# Altium schematic sheet MCU.SchDoc
size A3; Organization: Rotronic AG; Address1: Grindelstrasse 6; Address2: 8303 Bassersdorf; Address3: Switzerland; DocumentNumber: 2; SheetNumber: 2; SheetTotal: 10; Web_Address: www.rotronic.ch; E_Mail_Address: *@rotronic.ch; Fon: +41 (0)44 838 11 11; Fax: +41 (0)44 836 44 24
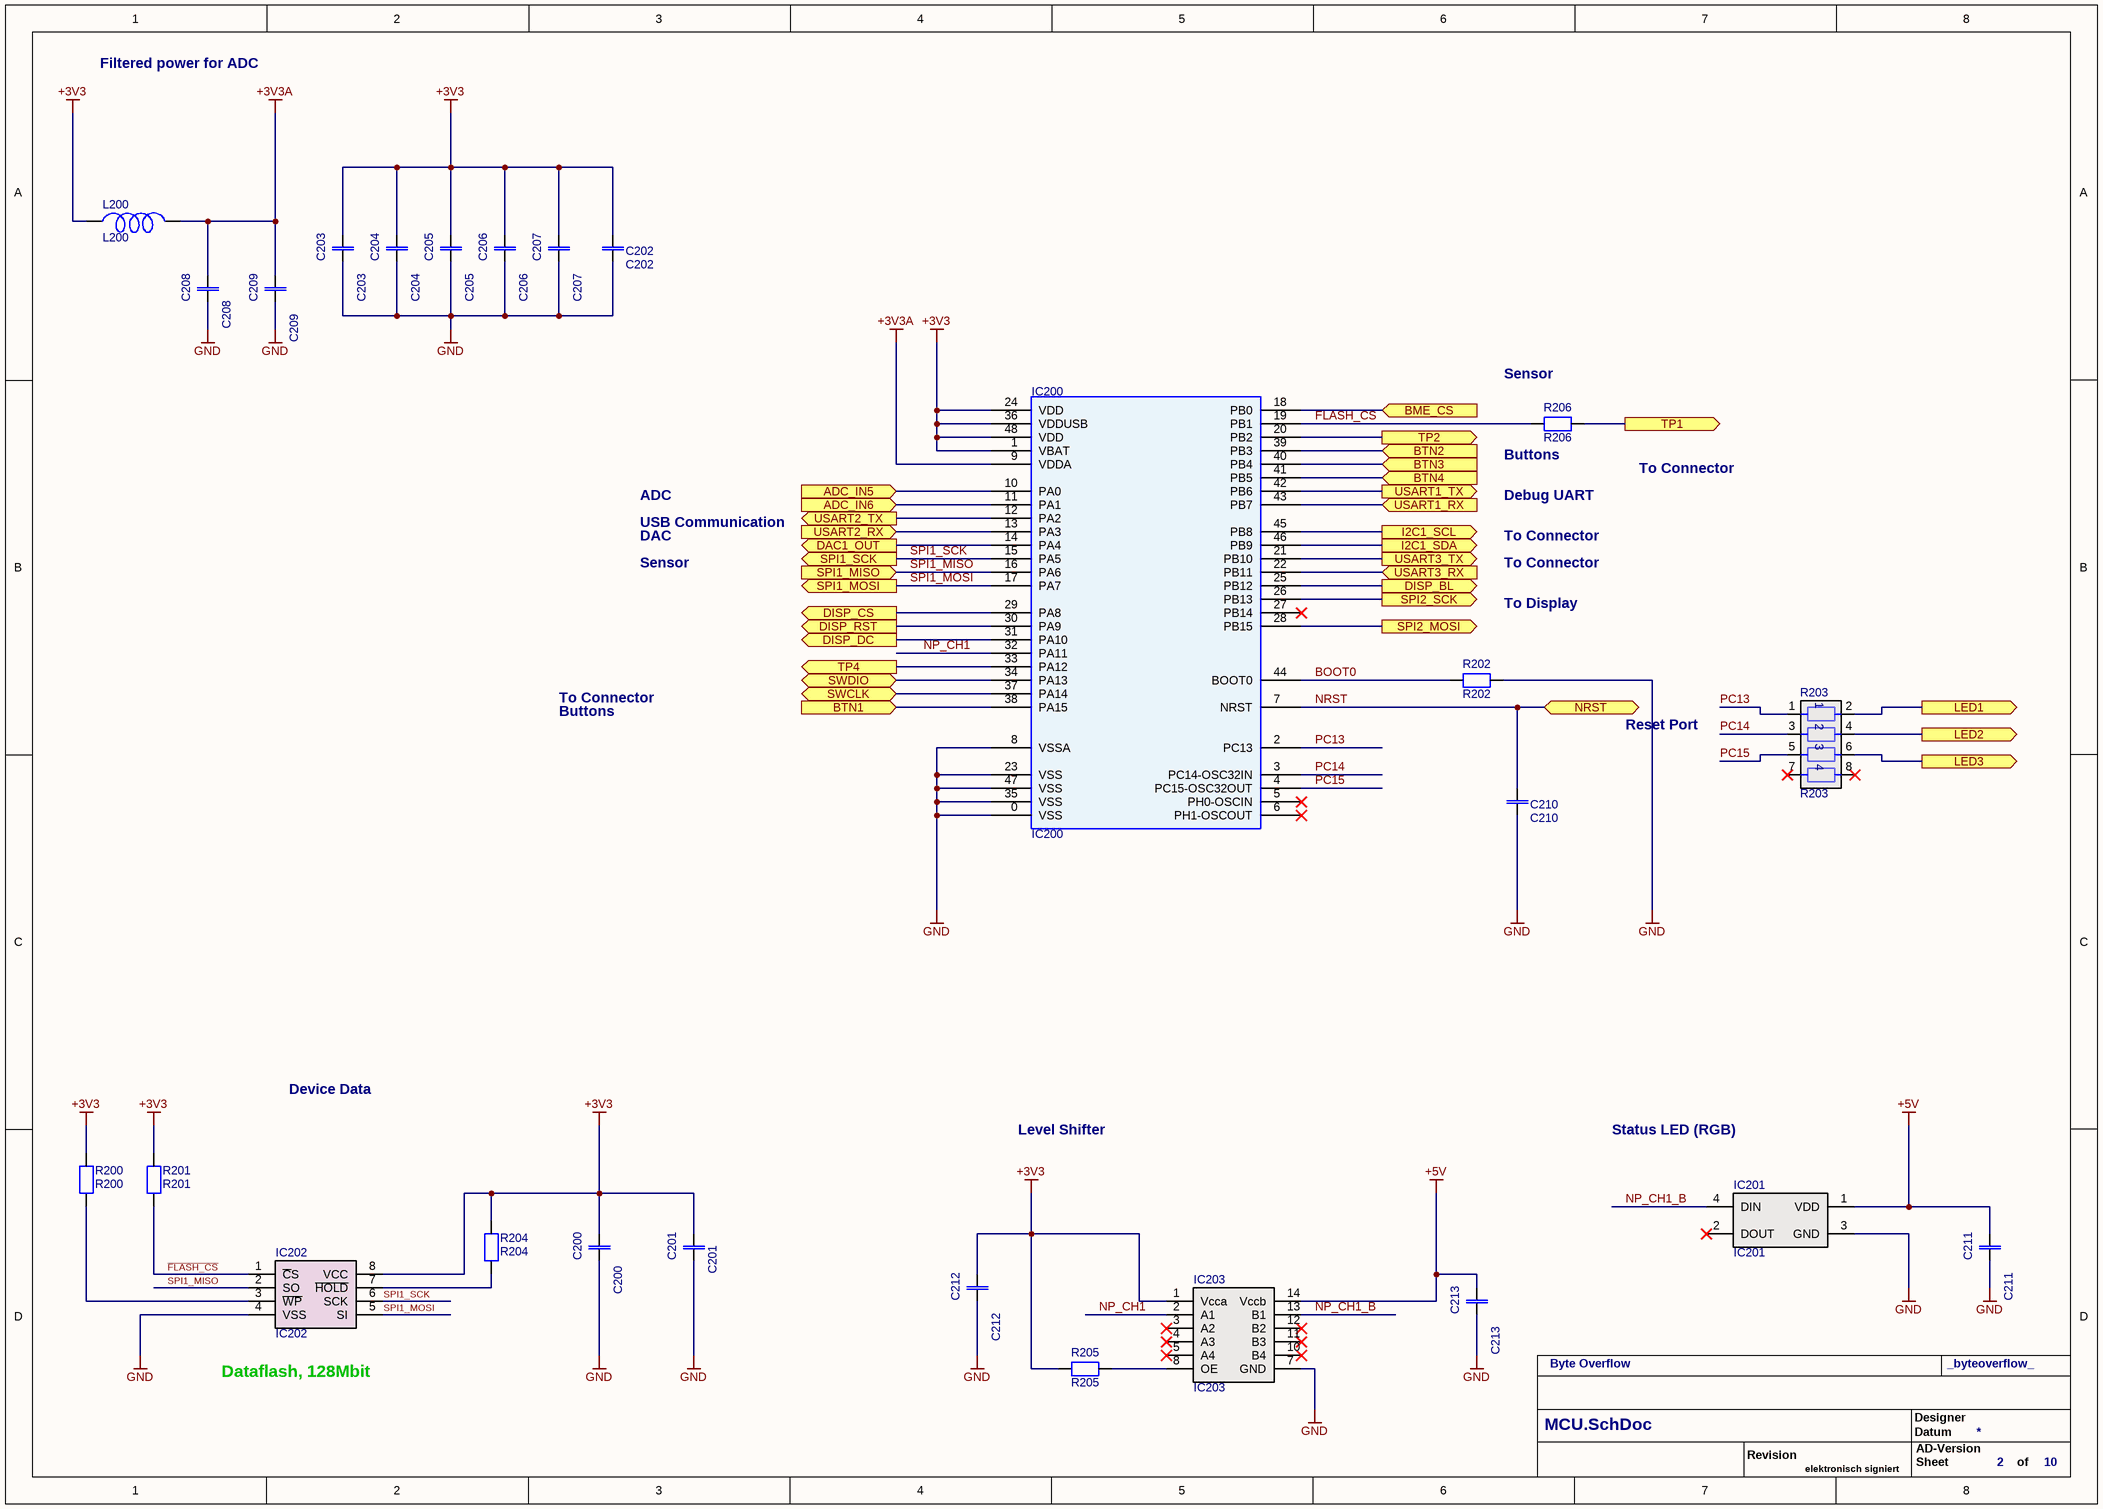
[diagram p0: MCU.SchDoc]

## Parts
C200  C200  [0603-1608]
C201  C201  [0805-2012]
C202  C202  [0603-1608]
C203  C203  [0603-1608]
C204  C204  [0603-1608]
C205  C205  [0603-1608]
C206  C206  [0603-1608]
C207  C207  [0603-1608]
C208  C208  [0805-2012]
C209  C209  [0603-1608]
C210  C210  [0603-1608]
C211  C211  [0603-1608]
C212  C212  [0603-1608]
C213  C213  [0603-1608]
IC200  IC200  [QFN48 7x7x0.9 WIZnet]
IC201  IC201  [LED_2812]
IC202  IC202  [SOIC-8]
IC203  IC203  [TSSOP14]
L200  L200  [0603-1608]
R200  R200  [0603-1608]
R201  R201  [0603-1608]
R202  R202  [0603-1608]
R203  R203  [Array-2010-4Way]
R204  R204  [0603-1608]
R205  R205  [0805-2012]
R206  R206  [0603-1608]

## Ports
ADC_IN5 (in), ADC_IN6 (in), BME_CS (in), BTN1 (in), BTN2 (in), BTN3 (in), BTN4 (in), DAC1_OUT (out), DISP_BL (out), DISP_CS (out), DISP_DC (out), DISP_RST (out), I2C1_SCL (out), I2C1_SDA (out), LED1 (out), LED2 (out), LED3 (out), NRST (bidir), SPI1_MISO (in), SPI1_MOSI (out), SPI1_SCK (out), SPI2_MOSI (out), SPI2_SCK (out), SWCLK (bidir), SWDIO (bidir), TP1 (out), TP2 (out), TP4 (out), USART1_RX (in), USART1_TX (out), USART2_RX (in), USART2_TX (out), USART3_RX (in), USART3_TX (out)

## Nets
+3V3: C200.1 C201.1 C202.1 C203.1 C204.1 C205.1 C206.1 C207.1 C212.1 IC200.1(VBAT) IC200.24(VDD) IC200.36(VDDUSB) IC200.48(VDD) IC202.8(VCC) IC203.1(Vcca) L200.1 R200.2 R201.2 R204.2 R205.1
+3V3A: C208.1 C209.1 IC200.9(VDDA) L200.2
+5V: C211.1 C213.1 IC201.1(VDD) IC203.14(Vccb)
GND: C200.2 C201.2 C202.2 C203.2 C204.2 C205.2 C206.2 C207.2 C208.2 C209.2 C210.2 C211.2 C212.2 C213.2 IC200.0(VSS) IC200.8(VSSA) IC200.23(VSS) IC200.35(VSS) IC200.47(VSS) IC201.3(GND) IC202.4(VSS) IC203.7(GND) R202.2
~{FLASH_CS}: IC200.19(PB1) IC202.1(~{C}S) R201.1 R206.1
ADC_IN5: IC200.10(PA0) ; port ADC_IN5
ADC_IN6: IC200.11(PA1) ; port ADC_IN6
BME_CS: IC200.18(PB0) ; port BME_CS
BOOT0: IC200.44(BOOT0) R202.1
BTN1: IC200.38(PA15) ; port BTN1
BTN2: IC200.39(PB3) ; port BTN2
BTN3: IC200.40(PB4) ; port BTN3
BTN4: IC200.41(PB5) ; port BTN4
DAC1_OUT: IC200.14(PA4) ; port DAC1_OUT
DISP_BL: IC200.25(PB12) ; port DISP_BL
DISP_CS: IC200.29(PA8) ; port DISP_CS
DISP_DC: IC200.31(PA10) ; port DISP_DC
DISP_RST: IC200.30(PA9) ; port DISP_RST
I2C1_SCL: IC200.45(PB8) ; port I2C1_SCL
I2C1_SDA: IC200.46(PB9) ; port I2C1_SDA
LED1: R203.2 ; port LED1
LED2: R203.4 ; port LED2
LED3: R203.6 ; port LED3
NP_CH1: IC200.32(PA11) IC203.2(A1)
NP_CH1_B: IC201.4(DIN) IC203.13(B1)
NRST: C210.1 IC200.7(NRST) ; port NRST
PC13: IC200.2(PC13) R203.1
PC14: IC200.3(PC14-OSC32IN) R203.3
PC15: IC200.4(PC15-OSC32OUT) R203.5
SPI1_MISO: IC200.16(PA6) IC202.2(SO) ; port SPI1_MISO
SPI1_MOSI: IC200.17(PA7) IC202.5(SI) ; port SPI1_MOSI
SPI1_SCK: IC200.15(PA5) IC202.6(SCK) ; port SPI1_SCK
SPI2_MOSI: IC200.28(PB15) ; port SPI2_MOSI
SPI2_SCK: IC200.26(PB13) ; port SPI2_SCK
SWCLK: IC200.37(PA14) ; port SWCLK
SWDIO: IC200.34(PA13) ; port SWDIO
TP1: R206.2 ; port TP1
TP2: IC200.20(PB2) ; port TP2
TP4: IC200.33(PA12) ; port TP4
USART1_RX: IC200.43(PB7) ; port USART1_RX
USART1_TX: IC200.42(PB6) ; port USART1_TX
USART2_RX: IC200.13(PA3) ; port USART2_RX
USART2_TX: IC200.12(PA2) ; port USART2_TX
USART3_RX: IC200.22(PB11) ; port USART3_RX
USART3_TX: IC200.21(PB10) ; port USART3_TX
NetIC202_3: IC202.3(~{WP}) R200.1
NetIC202_7: IC202.7(~{HOLD}) R204.1
NetIC203_8: IC203.8(OE) R205.2

Not connected (* = marked no-connect by the designer): IC200 5(PH0-OSCIN)* 6(PH1-OSCOUT)* 27(PB14)*; IC201 2(DOUT)*; IC203 3(A2)* 4(A3)* 5(A4)* 6(NC) 9(NC) 10(B4)* 11(B3)* 12(B2)*; R203 7* 8*

## Notes on the sheet
- Filtered power for ADC
- (near R206) Sensor
- ADC
- Debug UART
- (near R206) Buttons
- To Connector
- USB Communication
- Sensor
- DAC
- To Display
- Buttons
- Reset Port
- Device Data
- Level Shifter
- Status LED (RGB)
- (near IC202) Dataflash, 128Mbit
- Byte Overflow
- _byteoverflow_
- Revision
- Designer
- Datum
- AD-Version
- elektronisch signiert
- Sheet
- of

## Library data of the parts
C200 C210 = F0161: Capacitor; Part-Number: 63.0104.1450; Manufacturer: KEMET; Manufacturer Part Number: C0603C104K5RACTU; ID: F0161; Operating Range: -55°C to +125°C; Note: 100nF 50V X7R 10% Kemet C0603C104K5RACTU; Specification: 05.09.2013 OPT; Value: 100nF 50V; Designator: C 100nF 50V X7R; Component Type: Standard; ComponentLink1Description: Datasheet; ComponentLink1URL: http://www.kemet.com/kemet/web/homepage/kechome.nsf/vapubfiles/KEM_C1002_X7R_SMD.pdf/$file/KEM_C1002_X7R_SMD.pdf; Pin Count: 2; Price 100: 0.007; Price 1000: 0.007; Price Date: 02.12.2019 Pro Alpha; Changed: 05.09.2013 OPT; Price: 0.01; Availability Date: 15.11.2016 OPT; Flammability: n.a.; RoHS compliant: Yes; Status: Active; Part Status: Active; RoHS: RoHS Compliant; Supplier Part Number 1: 399-5089-1-ND; Supplier 1: Digi-Key
C201 C208 = F0127: Capacitor; Part-Number: 63.0105.1500; Manufacturer: Murata Electronics North America; Manufacturer Part Number: GRM21BF51H105ZA12L; ID: F0127; Operating Range: -30°C to +85°C; Note: 1uF 50V Y5V 20% Murata GRM21BF51H105ZA12L; Specification: 27.12.2012 OPT; Value: 1uF 50V; Designator: C 1uF 50V; Component Type: Standard; Pin Count: 2; Price 100: 0.067; Price 1000: 0.067; Price Date: 02.12.2019 Pro Alpha; Changed: 27.12.2012 OPT; Price: 0.118; Availability Date: 15.11.2016 OPT; Flammability: n.a.; RoHS compliant: Yes; Status: Active; ComponentLink1Description: Datasheet; ComponentLink1URL: http://www.murata.com/products/catalog/pdf/c02e.pdf; Part Status: Discontinued at Digi-Key; RoHS: RoHS Compliant; Supplier Part Number 1: 490-3903-1-ND; ComponentLink2Description: http://search.murata.co.jp/Ceramy/image/img/A01X/G101/ENG/GRM21BF51H105ZA12-01.pdf; ComponentLink2URL: http://search.murata.co.jp/Ceramy/image/img/A01X/G101/ENG/GRM21BF51H105ZA12-01.pdf; Supplier 1: Digi-Key
C202 = F0193: Capacitor; Part-Number: 63.7000.0032; Manufacturer: Murata Electronics North America; Manufacturer Part Number: GRM188R61E475ME11D; Designator: C 4.7uF 25V; ID: F0193; Operating Range: -55°C to +85°C; Note: 4.7uF 25V X5R 20% Murata Electronics GRM188R61E475ME11D; Specification: 02.09.2015 OPT; Value: 4.7uF 25V X5R; Component Type: Standard; ComponentLink1Description: Datasheet; ComponentLink1URL: http://search.murata.co.jp/Ceramy/image/img/A01X/partnumbering_e_01.pdf; Status: Active; Availability Date: 15.11.2016 OPT; RoHS compliant: Yes; Flammability: n.a.; ComponentLink2Description: http://search.murata.co.jp/Ceramy/image/img/A01X/G101/ENG/GRM188R61E475ME11-01.pdf; ComponentLink2URL: http://search.murata.co.jp/Ceramy/image/img/A01X/G101/ENG/GRM188R61E475ME11-01.pdf; Pin Count: 2; Price 100: 0.13; Price 1000: 0.11; Price Date: 02.12.2019 Pro Alpha; Changed: 02.09.2015 OPT; Price: 0.096; Supplier 1: Digi-Key; Supplier Part Number 1: GRM188R61E475ME11D-ND; Part Status: Active; RoHS: RoHS Compliant
C203-C207 C209 C211-C213 = F0161: Capacitor; Part-Number: 63.0104.1450; Manufacturer: KEMET; Manufacturer Part Number: C0603C104K5RACTU; Designator: C 100nF 50V X7R; ID: F0161; Operating Range: -55°C to +125°C; Note: 100nF 50V X7R 10% Kemet C0603C104K5RACTU; Specification: 05.09.2013 OPT; Value: 100nF 50V; Component Type: Standard; ComponentLink1Description: Datasheet; ComponentLink1URL: http://www.kemet.com/kemet/web/homepage/kechome.nsf/vapubfiles/KEM_C1002_X7R_SMD.pdf/$file/KEM_C1002_X7R_SMD.pdf; Status: Active; Availability Date: 15.11.2016 OPT; RoHS compliant: Yes; Flammability: n.a.; Pin Count: 2; Price 100: 0.007; Price 1000: 0.007; Price Date: 02.12.2019 Pro Alpha; Changed: 05.09.2013 OPT; Price: 0.01; Supplier 1: Digi-Key; Supplier Part Number 1: 399-5089-1-ND; Part Status: Active; RoHS: RoHS Compliant
IC200 = H0056: uC; Part-Number: 00.0000.0000; Manufacturer: STMicroelectronics; Designator: ST STM32L452CEU6; ID: H0056; Operating Range: -40°C to +85°C; Note: ARM Mikrocontroller - MCU STM32 Dyn Eff MCU 512 K 100 MHz CPU; Changed: 19.10.2022 PEK; Value: ST STM32L452CEU6; Component Type: Standard; ComponentLink1Description: Datasheet; ComponentLink1URL: https://www.st.com/resource/en/datasheet/stm32l452re.pdf; Status: Active; Availability Date: 19.10.2022 PEK; RoHS compliant: Yes; Flammability: n.a; Pin Count: 48; Price 100: 9.99; Price 1000: 9.99; Price Date: 19.10.2022 PEK; Specification: 19.10.2022 PEK; Price: 11.81; Supplier 1: Farnell; Manufacturer Part Number: STM32L452CEU6; Part Status: Active; RoHS: RoHS Compliant
IC201 = A0133: LED; Part-Number: 00.0000.0000; Manufacturer: China; ID: A0133; Operating Range: -40°C to +85°C; Note: Addressable RGB LED; Value: WS2812B; Specification: 14.11.2019 PEK; Designator: WS2812B; Component Type: Standard; ComponentLink1Description: Datasheet; ComponentLink1URL: https://cdn-shop.adafruit.com/datasheets/WS2812B.pdf; Status: Active; Availability Date: 14.11.2019 PEK; RoHS compliant: Yes; Flammability: n.a.; Pin Count: 4; Price 100: 0.4; Price 1000: 0.4; Verification: 14.11.2019 PEK; Changed: 14.11.2019 PEK; Price: 0.4; Price Date: 14.11.2019 PEK; Supplier: Aliexpress; Supplier Part Number: WS2812B; Manufacturer Part Number: WS2812B; Part Status: Active; RoHS: RoHS Compliant
IC202 = L0021: Memory; Part-Number: 00.0000.0000; Manufacturer: Microchip Technology; Designator: AT25M01-SHM-T; ID: L0021; Operating Range: -40°C to +85°C; Note: Atmel AT25M01-SHM-T SPI Serial EEPROM 1MBIT; Changed: 06.04.2016 OPT; Value: AT25M01-SHM-T; Component Type: Standard; ComponentLink1Description: Datasheet; ComponentLink1URL: http://www.atmel.com/images/atmel-8824-seeprom-at25m01-datasheet.pdf; Status: Active; Availability Date: 14.11.2016 OPT; RoHS compliant: Yes; Flammability: n.a.; Pin Count: 8; Price 100: 1.95; Price 1000: 1.75; Price Date: 06.04.2016 OPT; Specification: 06.04.2016 OPT; Price: 2.48; Supplier 1: Digi-Key; Supplier Part Number 1: AT25M01-SHM-TCT-ND; Manufacturer Part Number: AT25M01-SHM-T; Part Status: Discontinued at Digi-Key; RoHS: RoHS Compliant
IC203 = E0093: Level-shifter; Part-Number: 61.0104.9900; Manufacturer: Texas Instruments; ID: E0093; Operating Range: -40°C to +85°C; Note: Ti TXB0104PWR 4-Bit Bidirectional Voltage-level Translator With Automatic Direction Sensing; Specification: 06.08.2015 NEC; Value: TXB0104PWR; Designator: TXB0104; Component Type: Standard; ComponentLink1Description: Datasheet; ComponentLink1URL: http://www.ti.com/lit/ds/symlink/txb0104.pdf; Status: Active; Availability Date: 15.11.2016 OPT; RoHS compliant: Yes; Flammability: n.a.; Pin Count: 14; Price 100: 0.95; Price 1000: 0.55; Price Date: 02.12.2019 Pro Alpha; Changed: 06.08.2015 NEC; Price: 0.883; Supplier 1: Digi-Key; Supplier Part Number 1: 296-21929-1-ND; Manufacturer Part Number: TXB0104PWR; Part Status: Active; RoHS: RoHS Compliant
L200 = M0007: Inductor; Part-Number: 69.0220.0000; Manufacturer: Taiyo Yuden; Manufacturer Part Number: HK160822NJ-T; Designator: L 22nH; ID: M0007; Operating Range: -40°C to +85°C; Note: Taiyo Yuden HK160822NJ-T Festinduktoren INDCTR HIFREQ MLTLYR 0603 22nH 5%; Specification: 19.09.2011 MLP; Verification: 05.07.2012 OPT; Value: 22nH; Component Type: Standard; Status: Active; Availability Date: 15.11.2016 OPT; RoHS compliant: Yes; Flammability: n.a.; Pin Count: 2; Price 100: 0.076; Price 1000: 0.05; Price Date: 02.12.2019 Pro Alpha; Changed: 19.09.2011 MLP; Price: 0.029; Supplier 1: Digi-Key; Supplier Part Number 1: 587-1549-1-ND; Part Status: Active; RoHS: RoHS Compliant
R200 R201 R204 = Q0017: Resistor; Part-Number: 71.1002.1300; Manufacturer: Vishay Dale; Manufacturer Part Number: CRCW060310K0FKEAHP; ID: Q0017; Note: 10k 1% 100ppm 1/10W Vishay CRCW060310K0FKEA; Changed: 19.09.2011 MLP; Verification: 05.07.2012 OPT; Value: 10k; Operating Range: -55°C to +155°C; Designator: R 10k 1%; Component Type: Standard; Pin Count: 2; Price Date: 02.12.2019 Pro Alpha; Specification: 19.09.2011 MLP; Price: 0.001; Price 100: 0.002; Price 1000: 0.002; Availability Date: 16.11.2016 OPT; Flammability: n.a.; RoHS compliant: Yes; Status: Active; Part Status: Active; RoHS: RoHS Compliant; Supplier: Digi-Key; Supplier Part Number: 541-10.0KSCT-ND; ComponentLink1Description: http://www.vishay.com/docs/20043/crcwhpe3.pdf; ComponentLink1URL: http://www.vishay.com/docs/20043/crcwhpe3.pdf
R202 = Q0017: Resistor; Part-Number: 71.1002.1300; Manufacturer: Vishay Dale; Manufacturer Part Number: CRCW060310K0FKEAHP; Designator: R 10k 1%; ID: Q0017; Operating Range: -55°C to +155°C; Note: 10k 1% 100ppm 1/10W Vishay CRCW060310K0FKEA; Changed: 19.09.2011 MLP; Verification: 05.07.2012 OPT; Value: 10k; Component Type: Standard; ComponentLink1Description: http://www.vishay.com/docs/20043/crcwhpe3.pdf; ComponentLink1URL: http://www.vishay.com/docs/20043/crcwhpe3.pdf; Status: Active; Availability Date: 16.11.2016 OPT; RoHS compliant: Yes; Flammability: n.a.; Pin Count: 2; Price 100: 0.002; Price 1000: 0.002; Price Date: 02.12.2019 Pro Alpha; Specification: 19.09.2011 MLP; Price: 0.001; Supplier: Digi-Key; Supplier Part Number: 541-10.0KSCT-ND; Part Status: Active; RoHS: RoHS Compliant
R203 = Q0303: Resistor; Part-Number: 71.1000.1399; Manufacturer: Vishay Dale; Manufacturer Part Number: CRA04S083100RJTD; Designator: R 100E 4x 5.0%; ID: Q0303; Operating Range: -55°C to +150°C; Note: 100E 4x 5.0% 200ppm 1/16W Vishay CRA04S083100RJTD; Changed: 23.09.2014 OPT; Specification: 30.06.2014 OPT; Value: 100E 4x 5.0%; Component Type: Standard; ComponentLink1Description: Datasheet; ComponentLink1URL: http://www.mouser.com/ds/2/427/cra04s-103900.pdf; Status: Active; Availability Date: 16.11.2016 OPT; RoHS compliant: Yes; Flammability: n.a.; ComponentLink2Description: http://www.vishay.com/docs/31043/cra04s.pdf; ComponentLink2URL: http://www.vishay.com/docs/31043/cra04s.pdf; Pin Count: 2; Price 100: 0.077; Price 1000: 0.058; Price Date: 02.12.2019 Pro Alpha; Price: 0.025; Supplier: Digi-Key; Supplier Part Number: CRA4S8100CT-ND; Part Status: Active; RoHS: RoHS Compliant
R205 = Q0244: Resistor; Part-Number: 71.0000.0500; Manufacturer: Vishay Dale; Manufacturer Part Number: CRCW08050000Z0EAHP; Designator: R 0E 1%; ID: Q0244; Operating Range: -55°C to +155°C; Note: 0E 1.0% Vishay/Dale CRCW08050000Z0EA; Changed: 23.04.2013 OPT; Verification: 05.03.2013 ENP; Value: 0E 1%; Component Type: Standard; ComponentLink1Description: Datasheet; ComponentLink1URL: http://www.mouser.com/ds/2/427/dcrcwe3-109170.pdf; Status: Active; Availability Date: 16.11.2016 OPT; RoHS compliant: Yes; Flammability: n.a.; ComponentLink2Description: http://www.vishay.com/docs/20043/crcwhpe3.pdf; ComponentLink2URL: http://www.vishay.com/docs/20043/crcwhpe3.pdf; Pin Count: 2; Price 100: 0.007; Price 1000: 0.007; Price Date: 02.12.2019 Pro Alpha; Specification: 23.04.2013 OPT; Price: 0.005; Supplier: Digi-Key; Supplier Part Number: 541-0.0TBCT-ND; Part Status: Active; RoHS: RoHS Compliant
R206 = Q0011: Resistor; Part-Number: 71.1000.1300; Manufacturer: Vishay Dale; Manufacturer Part Number: CRCW0603100RFKEA; Designator: R 100E 1%; ID: Q0011; Operating Range: -55°C to +155°C; Note: 100E 1% 100ppm 1/10W Vishay / Dale CRCW0603100RFKTB; Changed: 19.09.2011 MLP; Verification: 05.07.2012 OPT; Value: 100E 1%; Component Type: Standard; ComponentLink1Description: http://www.vishay.com/docs/20035/dcrcwe3.pdf; ComponentLink1URL: http://www.vishay.com/docs/20035/dcrcwe3.pdf; Status: Active; Availability Date: 16.11.2016 OPT; RoHS compliant: Yes; Flammability: n.a.; Pin Count: 2; Price 100: 0.002; Price 1000: 0.002; Price Date: 02.12.2019 Pro Alpha; Specification: 19.09.2011 MLP; Price: 0.002; Supplier: Digi-Key; Supplier Part Number: 541-100HCT-ND; Part Status: Active; RoHS: RoHS Compliant